# EAGLE schematic ble112_shield (EAGLE 7.2.0)
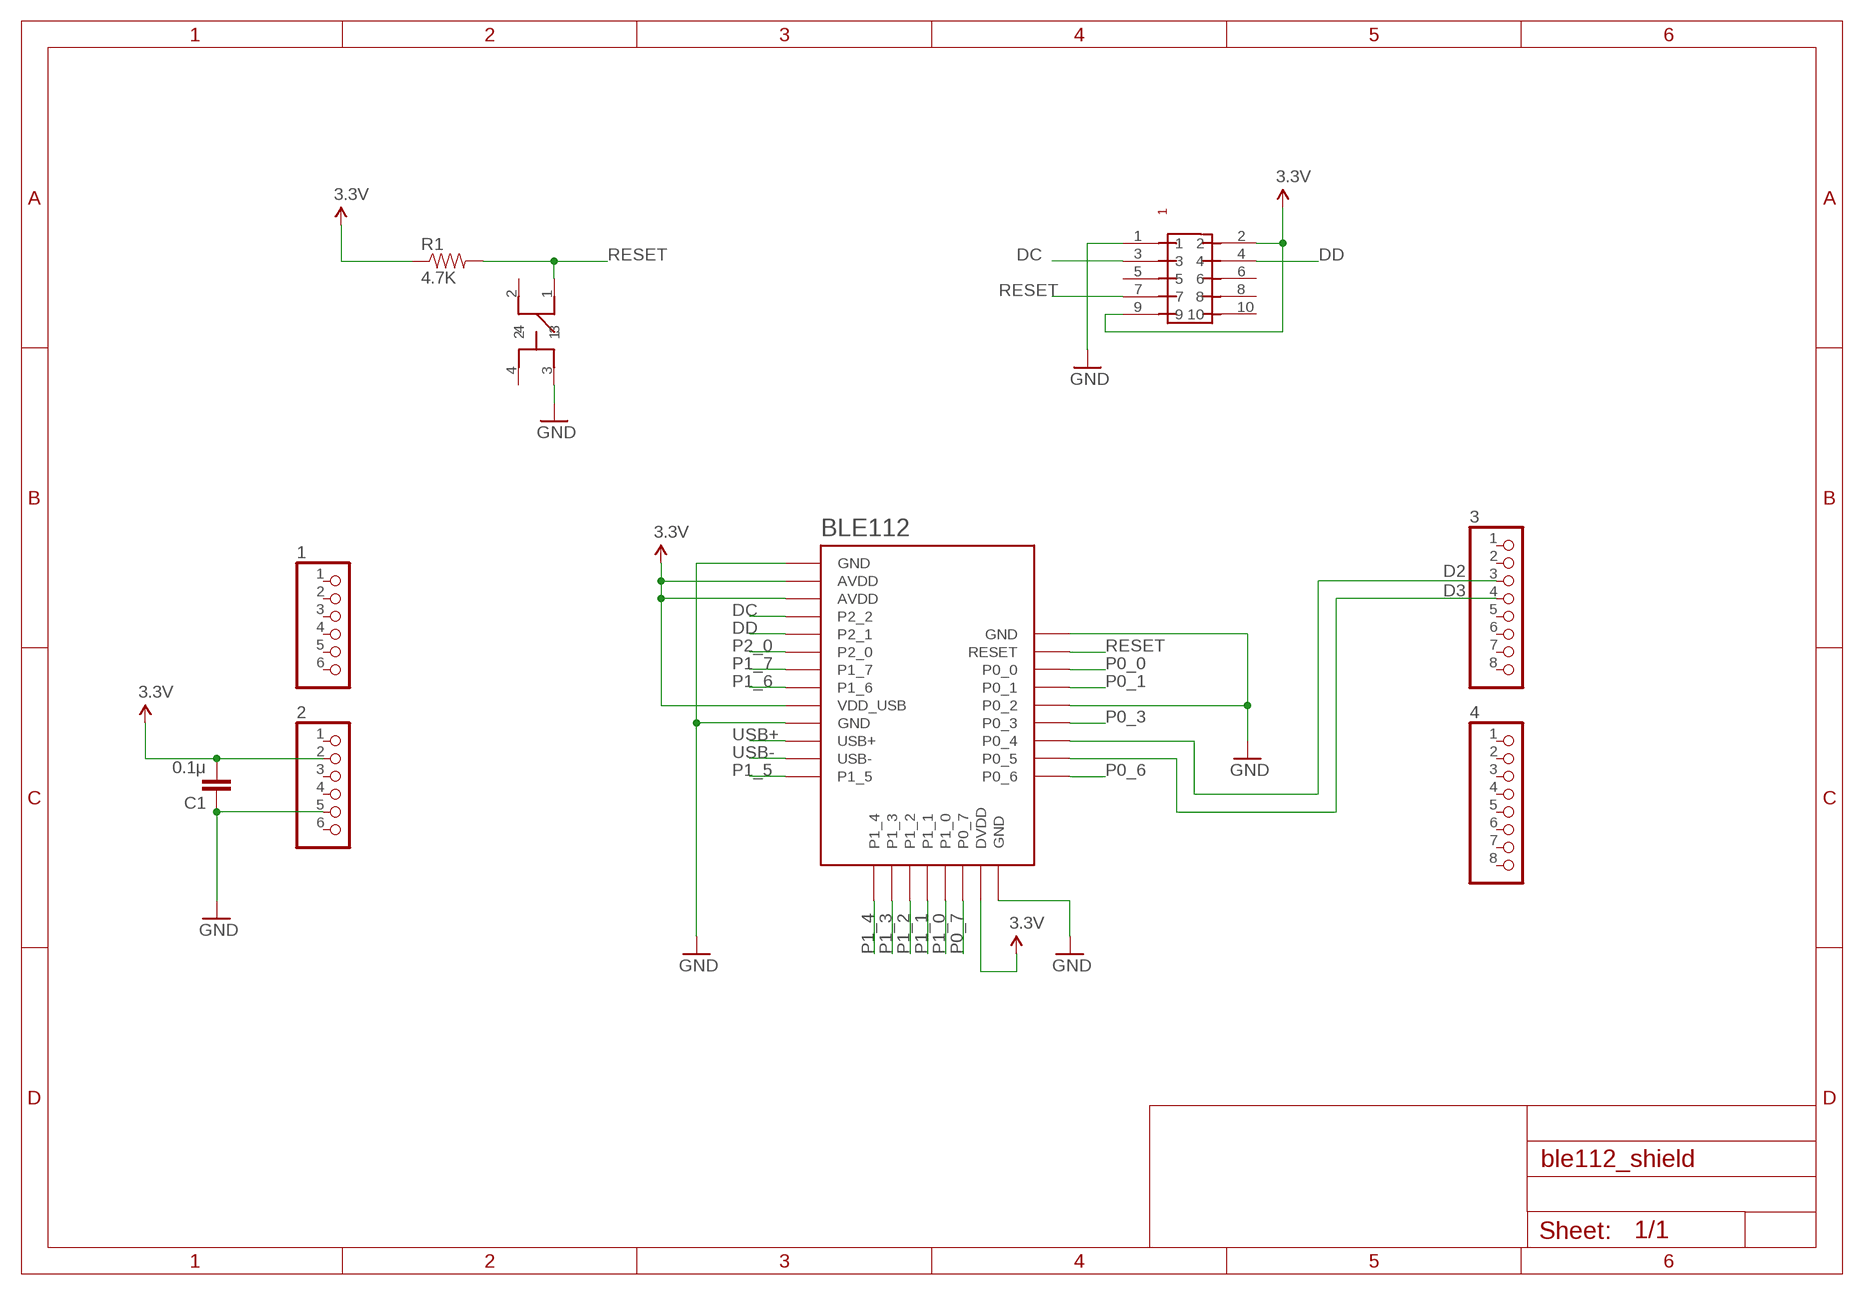
[diagram p0: schematic, sheet 1]

## Parts
1  PINHD-1X6CB  [1X06-CLEANBIG]
2  PINHD-1X6CB  [1X06-CLEANBIG]
3  PINHD-1X8CLEANBIG  [1X08-CLEANBIG]
4  PINHD-1X8CLEANBIG  [1X08-CLEANBIG]
BLE112  SF-BLUEGIGA_BLE112-A-VISUAL  [SF-BLUEGIGA_BLE112-A]
C1  0.1μ  CAP0603-CAP  [0603-CAP]
R1  4.7K  RESISTOR0603-RES  [0603-RES]
U$1  PIN-HEADER-SMT(1.27MM)2X5  [PIN-HEADER-SMT(1.27MM)2X5]
U$4  SWITCH-LS6J2M-T  [SWICTH-LS6J2M-T]

## Nets
3.3V: 2.2 BLE112.AVDD1(AVDD) BLE112.AVDD2(AVDD) BLE112.DVDD BLE112.VDD_USB C1.2 R1.1 U$1.2 U$1.9
D2: 3.3 BLE112.P0_4
D3: 3.4 BLE112.P0_5
DC: BLE112.P2_2 U$1.3
DD: BLE112.P2_1 U$1.4
GND: 2.5 BLE112.GND1(GND) BLE112.GND2(GND) BLE112.GND3(GND) BLE112.GND4(GND) BLE112.P0_2 C1.1 U$1.1 U$4.3
P0_0: BLE112.P0_0
P0_1: BLE112.P0_1
P0_3: BLE112.P0_3
P0_6: BLE112.P0_6
P0_7: BLE112.P0_7
P1_0: BLE112.P1_0
P1_1: BLE112.P1_1
P1_2: BLE112.P1_2
P1_3: BLE112.P1_3
P1_4: BLE112.P1_4
P1_5: BLE112.P1_5
P1_6: BLE112.P1_6
P1_7: BLE112.P1_7
P2_0: BLE112.P2_0
RESET: BLE112.RESET R1.2 U$1.7 U$4.1
USB+: BLE112.USB+
USB-: BLE112.USB-
Unconnected: 1.1 1.2 1.3 1.4 1.5 1.6 2.1 2.3 2.4 2.6 3.1 3.2 3.5 3.6 3.7 3.8 4.1 4.2 4.3 4.4 4.5 4.6 4.7 4.8 U$1.5 U$1.6 U$1.8 U$1.10 U$4.2 U$4.4

## Library data of the parts
1 2 = adafruit:PINHD-1X6: PIN HEADER
3 4 = adafruit:PINHD-1X8: PIN HEADER
BLE112 = ble112:SF-BLUEGIGA_BLE112-A-VISUAL: Bluetooth Low Energy single-mode module - Bluetooth 4.0, chip antenna
C1 = SparkFun:CAP: Capacitor Standard 0603 ceramic capacitor, and 0.1" leaded capacitor.
R1 = SparkFun:RESISTOR: Resistor Basic schematic elements and footprints for 0603, 1206, and PTH resistors.
U$1 = gclue:PIN-HEADER-SMT(1.27MM)2X5: PIN-HEADER-SMT (1.27MM) 2x5
U$4 = gclue:SWITCH-LS6J2M-T